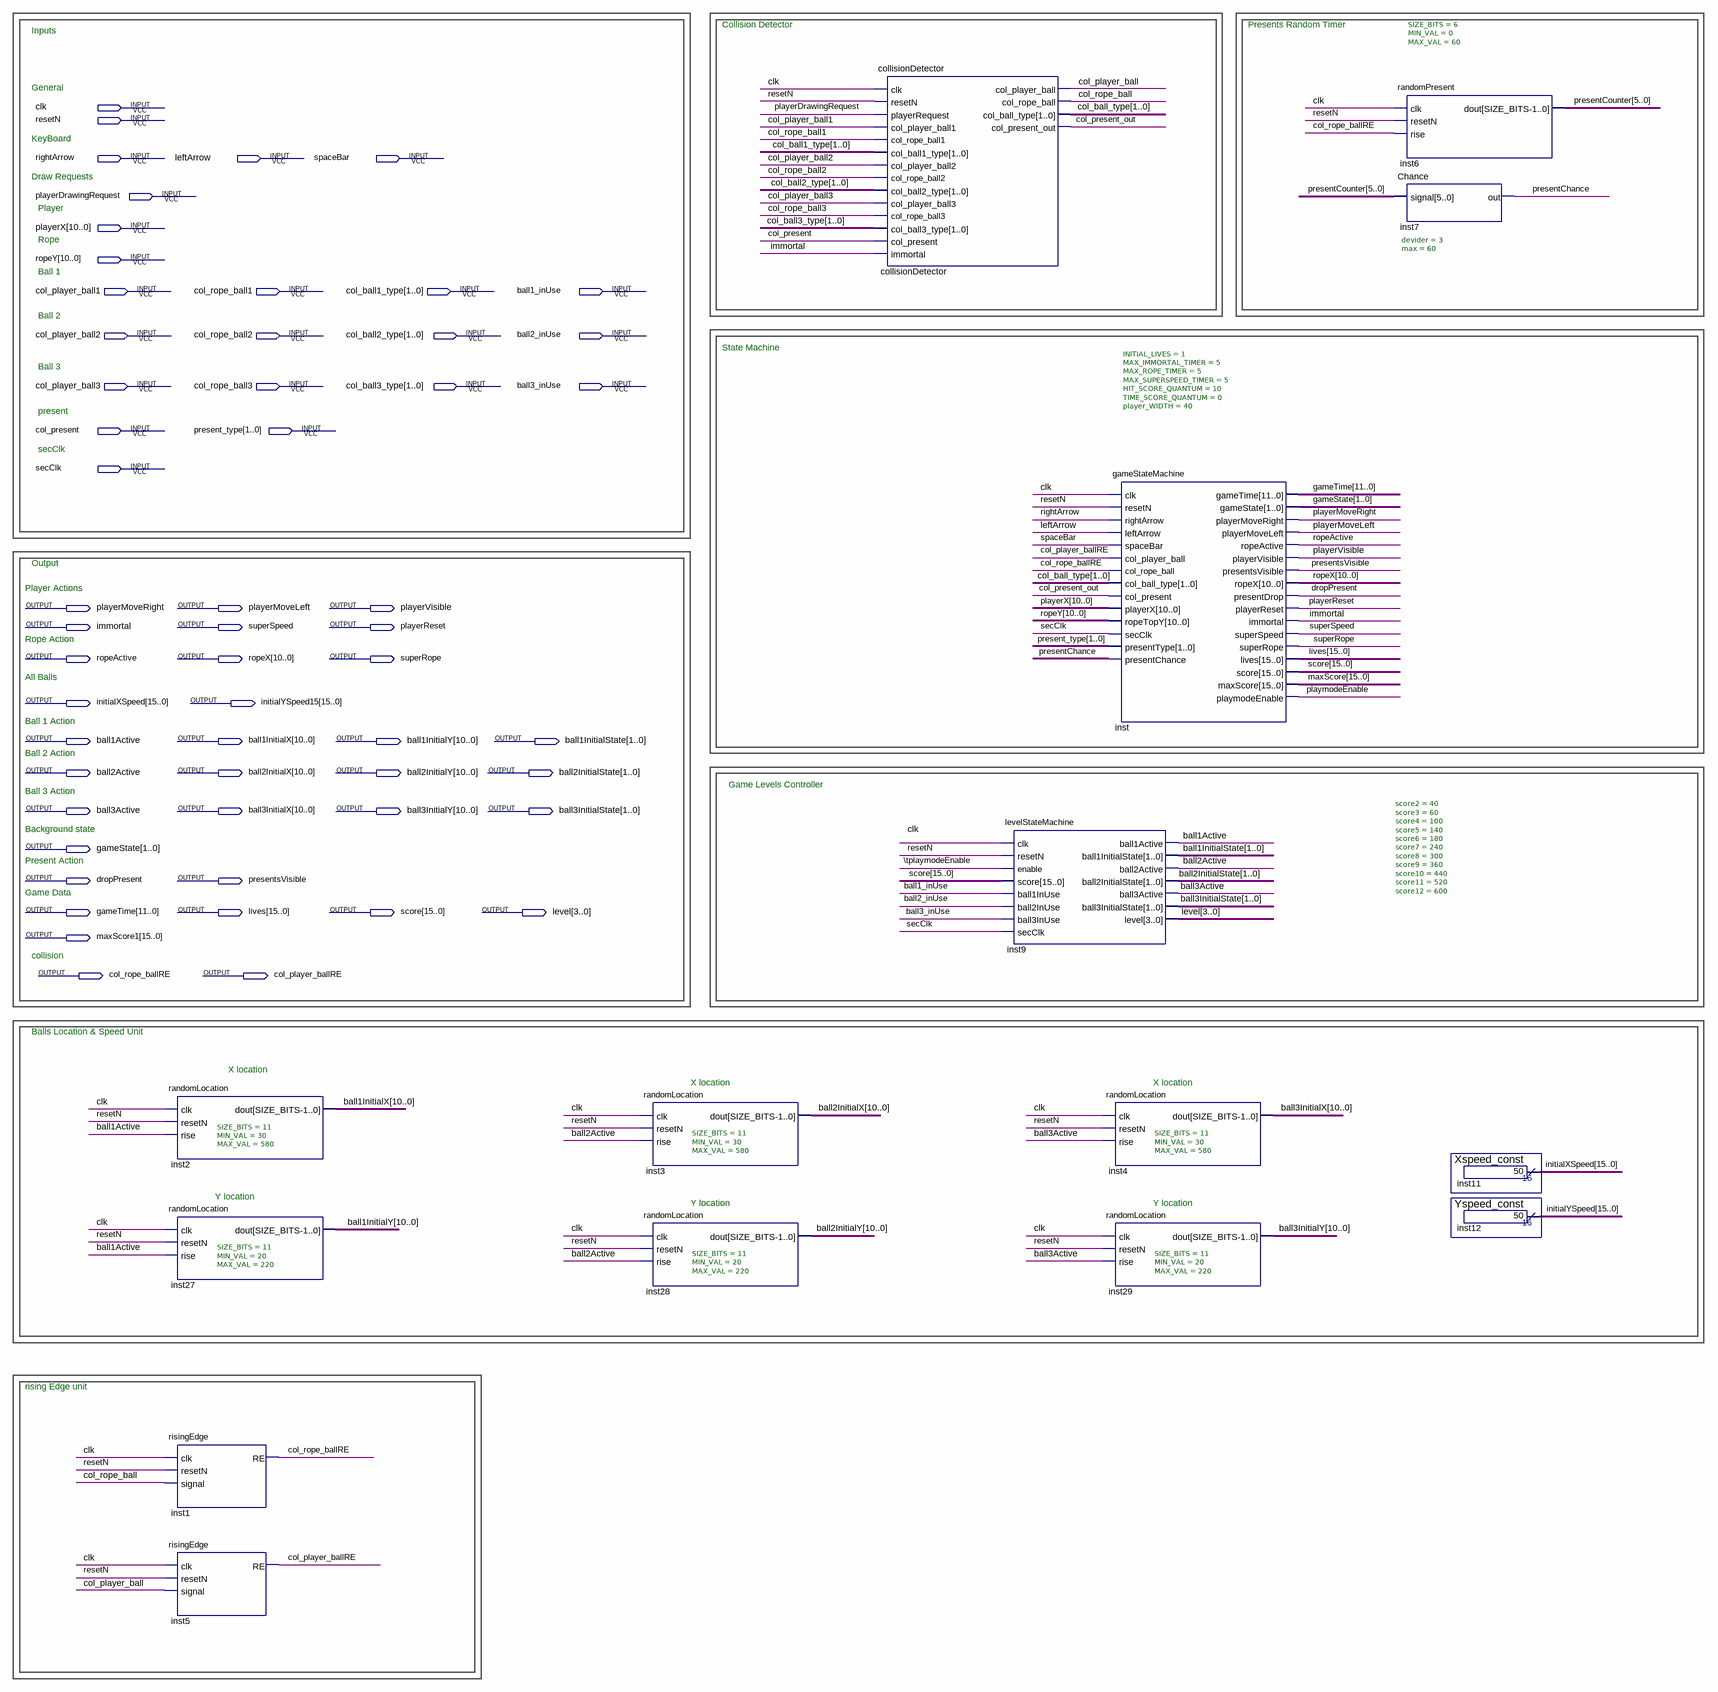
[diagram p0: schematic sheet]
// Quartus schematic gameControllerTop.bdf as structural Verilog: 15 symbols, 56 pins
module gameControllerTop (
  input  clk,
  input  resetN,
  input  rightArrow,
  input  leftArrow,
  input  spaceBar,
  input  playerDrawingRequest,
  input  [10:0] playerX,
  input  [10:0] ropeY,
  input  col_player_ball1,
  input  col_rope_ball1,
  input  [1:0] col_ball1_type,
  input  ball1_inUse,
  input  col_player_ball2,
  input  col_rope_ball2,
  input  [1:0] col_ball2_type,
  input  ball2_inUse,
  input  col_player_ball3,
  input  col_rope_ball3,
  input  [1:0] col_ball3_type,
  input  ball3_inUse,
  input  col_present,
  input  [1:0] present_type,
  input  secClk,
  output playerMoveRight,
  output playerMoveLeft,
  output playerVisible,
  output immortal,
  output superSpeed,
  output playerReset,
  output ropeActive,
  output [10:0] ropeX,
  output superRope,
  output [15:0] initialXSpeed,
  output [15:0] initialYSpeed15,
  output ball1Active,
  output [10:0] ball1InitialX,
  output [10:0] ball1InitialY,
  output [1:0] ball1InitialState,
  output ball2Active,
  output [10:0] ball2InitialX,
  output [10:0] ball2InitialY,
  output [1:0] ball2InitialState,
  output ball3Active,
  output [10:0] ball3InitialX,
  output [10:0] ball3InitialY,
  output [1:0] ball3InitialState,
  output [1:0] gameState,
  output dropPresent,
  output presentsVisible,
  output [11:0] gameTime,
  output [15:0] lives,
  output [15:0] score,
  output [3:0] level,
  output [15:0] maxScore1,
  output col_rope_ballRE,
  output col_player_ballRE
);

  wire \\tplaymodeEnable , col_player_ball, col_present_out, col_rope_ball, playmodeEnable, presentChance;
  wire [1:0] col_ball_type;
  wire [5:0] presentCounter;
  wire [15:0] initialYSpeed, maxScore;

  randomLocation #(.SIZE_BITS(11), .MIN_VAL(30), .MAX_VAL(580)) inst2 (
    .clk(clk), .resetN(resetN), .rise(ball1Active), .dout(ball1InitialX));
  randomLocation #(.SIZE_BITS(11), .MIN_VAL(20), .MAX_VAL(220)) inst27 (
    .clk(clk), .resetN(resetN), .rise(ball1Active), .dout(ball1InitialY));
  risingEdge inst1 (.clk(clk), .resetN(resetN), .signal(col_rope_ball), .RE(col_rope_ballRE));
  risingEdge inst5 (.clk(clk), .resetN(resetN), .signal(col_player_ball), .RE(col_player_ballRE));
  randomLocation #(.SIZE_BITS(11), .MIN_VAL(30), .MAX_VAL(580)) inst3 (
    .clk(clk), .resetN(resetN), .rise(ball2Active), .dout(ball2InitialX));
  randomLocation #(.SIZE_BITS(11), .MIN_VAL(20), .MAX_VAL(220)) inst28 (
    .clk(clk), .resetN(resetN), .rise(ball2Active), .dout(ball2InitialY));
  collisionDetector collisionDetector (
    .clk(clk), .resetN(resetN), .playerRequest(playerDrawingRequest), .col_player_ball1(col_player_ball1),
    .col_rope_ball1(col_rope_ball1), .col_ball1_type(col_ball1_type), .col_player_ball2(col_player_ball2),
    .col_rope_ball2(col_rope_ball2), .col_ball2_type(col_ball2_type), .col_player_ball3(col_player_ball3),
    .col_rope_ball3(col_rope_ball3), .col_ball3_type(col_ball3_type), .col_present(col_present),
    .immortal(immortal), .col_player_ball(col_player_ball), .col_rope_ball(col_rope_ball),
    .col_ball_type(col_ball_type), .col_present_out(col_present_out));
  levelStateMachine #(.score2(40), .score3(60), .score4(100), .score5(140), .score6(180), .score7(240), .score8(300), .score9(360), .score10(440), .score11(520), .score12(600)) inst9 (
    .clk(clk), .resetN(resetN), .enable(\\tplaymodeEnable ), .score(score), .ball1InUse(ball1_inUse),
    .ball2InUse(ball2_inUse), .ball3InUse(ball3_inUse), .secClk(secClk), .ball1Active(ball1Active),
    .ball1InitialState(ball1InitialState), .ball2Active(ball2Active), .ball2InitialState(ball2InitialState),
    .ball3Active(ball3Active), .ball3InitialState(ball3InitialState), .level(level));
  gameStateMachine #(.INITIAL_LIVES(1), .MAX_IMMORTAL_TIMER(5), .MAX_ROPE_TIMER(5), .MAX_SUPERSPEED_TIMER(5), .HIT_SCORE_QUANTUM(10), .TIME_SCORE_QUANTUM(0), .player_WIDTH(40)) inst (
    .clk(clk), .resetN(resetN), .rightArrow(rightArrow), .leftArrow(leftArrow), .spaceBar(spaceBar),
    .col_player_ball(col_player_ballRE), .col_rope_ball(col_rope_ballRE), .col_ball_type(col_ball_type),
    .col_present(col_present_out), .playerX(playerX), .ropeTopY(ropeY), .secClk(secClk),
    .presentType(present_type), .presentChance(presentChance), .gameTime(gameTime), .gameState(gameState),
    .playerMoveRight(playerMoveRight), .playerMoveLeft(playerMoveLeft), .ropeActive(ropeActive),
    .playerVisible(playerVisible), .presentsVisible(presentsVisible), .ropeX(ropeX),
    .presentDrop(dropPresent), .playerReset(playerReset), .immortal(immortal), .superSpeed(superSpeed),
    .superRope(superRope), .lives(lives), .score(score), .maxScore(maxScore), .playmodeEnable(playmodeEnable));
  randomLocation #(.SIZE_BITS(11), .MIN_VAL(30), .MAX_VAL(580)) inst4 (
    .clk(clk), .resetN(resetN), .rise(ball3Active), .dout(ball3InitialX));
  randomLocation #(.SIZE_BITS(11), .MIN_VAL(20), .MAX_VAL(220)) inst29 (
    .clk(clk), .resetN(resetN), .rise(ball3Active), .dout(ball3InitialY));
  randomPresent #(.SIZE_BITS(6), .MIN_VAL(0), .MAX_VAL(60)) inst6 (
    .clk(clk), .resetN(resetN), .rise(col_rope_ballRE), .dout(presentCounter));
  Chance #(.devider(3), .max(60)) inst7 (.signal(presentCounter), .out(presentChance));
  Xspeed_const inst11 (.result(initialXSpeed));
  Yspeed_const inst12 (.result(initialYSpeed));

  // Notes on the sheet:
  //   Collision Detector
  //   Presents Random Timer
  //   Inputs
  //   General
  //   KeyBoard
  //   Draw Requests
  //   Player
  //   Rope
  //   Ball 1
  //   Ball 2
  //   State Machine
  //   Ball 3
  //   present
  //   secClk
  //   Output
  //   Player Actions
  //   Rope Action
  //   All Balls
  //   Ball 1 Action
  //   Ball 2 Action
  //   Game Levels Controller
  //   Ball 3 Action
  //   Background state
  //   Present Action
  //   Game Data
  //   collision
  //   Balls Location & Speed Unit
  //   X location
  //   X location
  //   X location
  //   Y location
  //   Y location
  //   Y location
  //   rising Edge unit
endmodule
